# EAGLE design Esp8266_prot16_v5 (EAGLE 8.4.0)
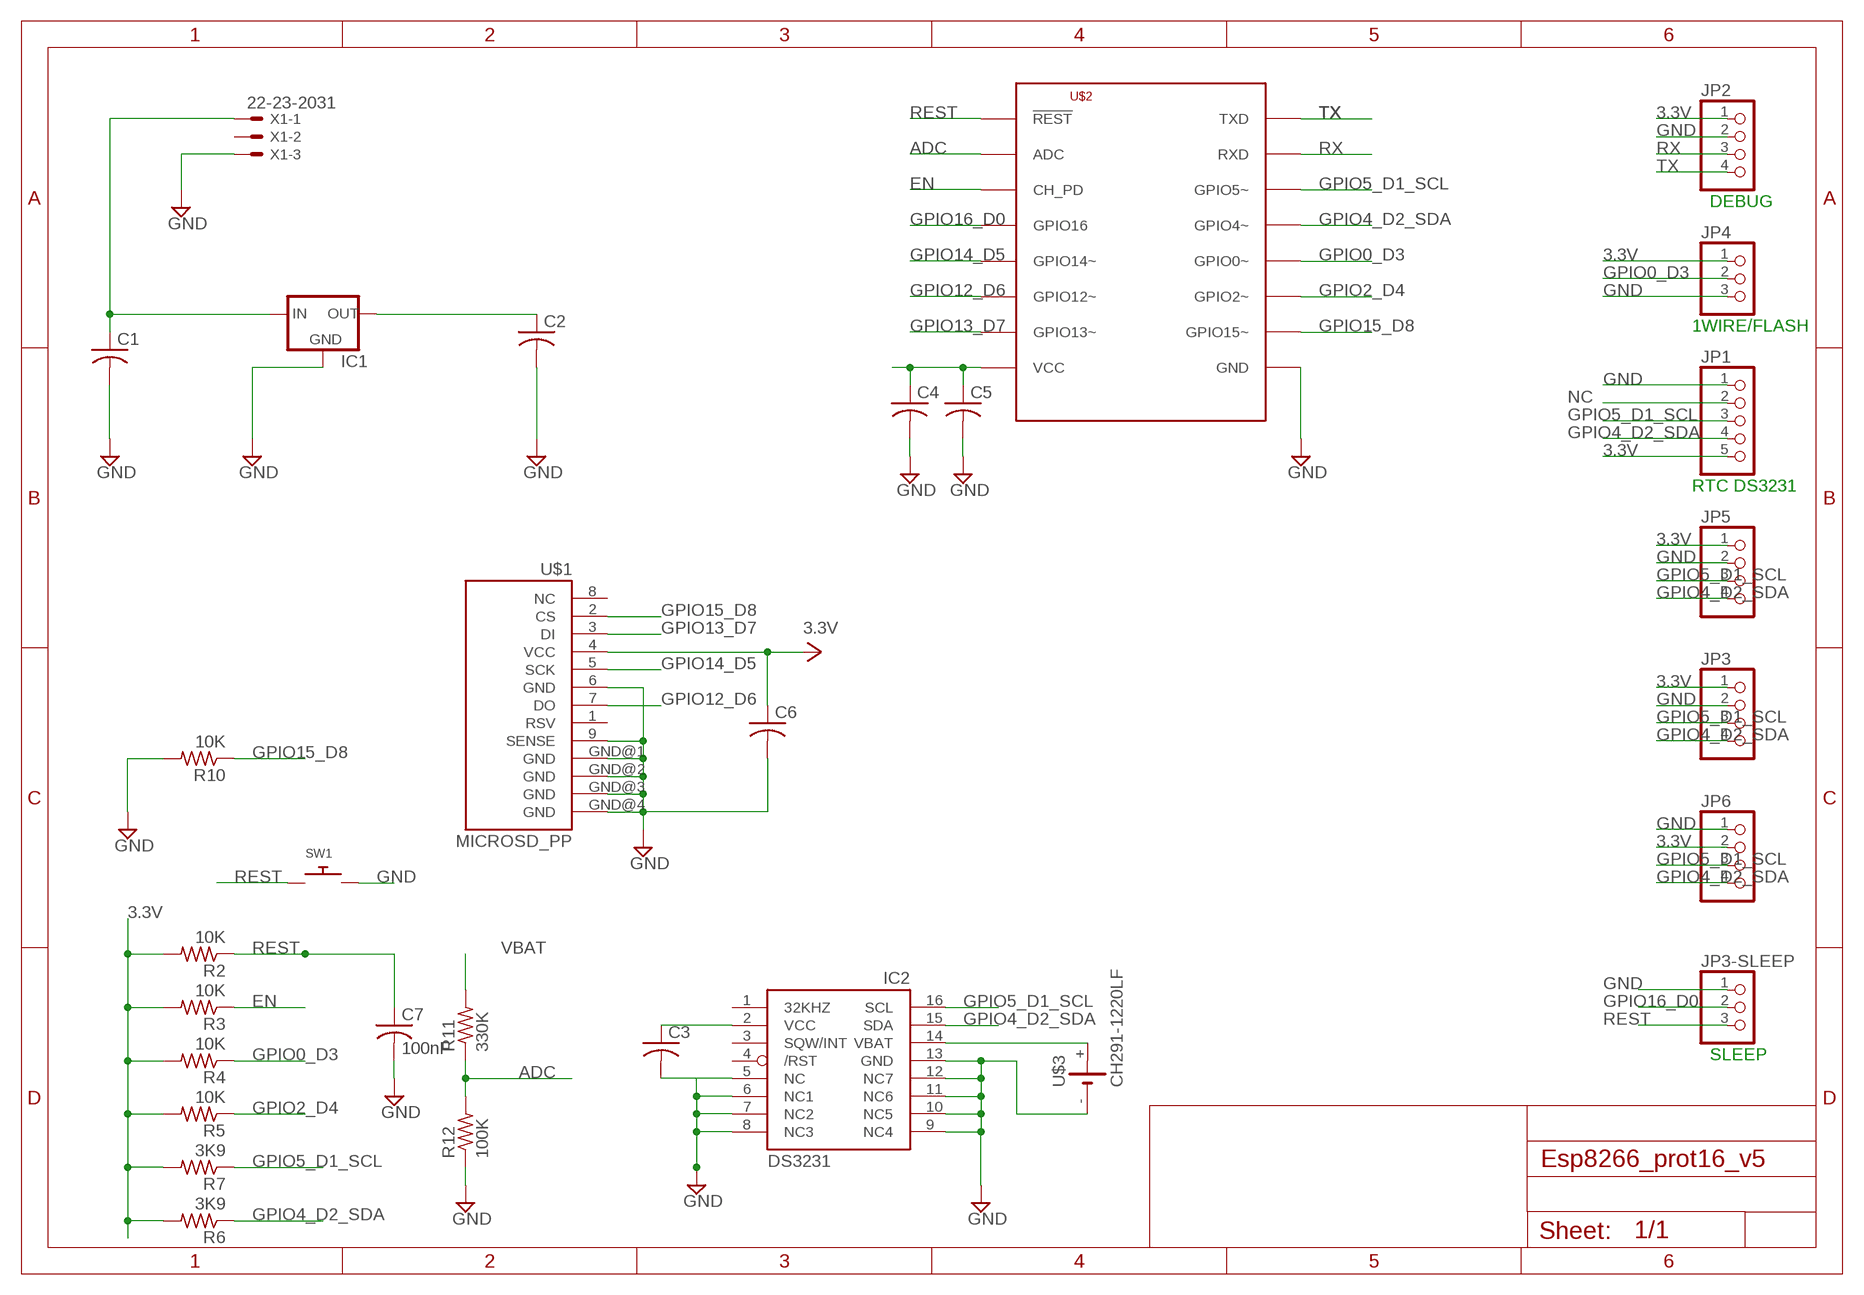
[diagram p0: schematic, sheet 1]

## Parts
C1  C-USC0805K  [C0805K]
C2  C-USC0805K  [C0805K]
C3  C-USC0805K  [C0805K]
C4  C-USC0805K  [C0805K]
C5  C-USC0805K  [C0805K]
C6  C-USC0805K  [C0805K]
C7  100nF  C-USC0805K  [C0805K]
IC1  XC63FPP  [SOT89R]
IC2  DS3231/SO  [SO16W]
JP1  PINHD-1X5/90  [1X05/90]
JP2  PINHD-1X4  [1X04]
JP3  PINHD-1X4/90  [1X04/90]
JP3-SLEEP  PINHD-1X3/90  [1X03/90]
JP4  PINHD-1X3  [1X03]
JP5  PINHD-1X4  [1X04]
JP6  PINHD-1X4  [1X04]
R2  10K  R-US_R0805  [R0805]
R3  10K  R-US_R0805  [R0805]
R4  10K  R-US_R0805  [R0805]
R5  10K  R-US_R0805  [R0805]
R6  3K9  R-US_R0805  [R0805]
R7  3K9  R-US_R0805  [R0805]
R10  10K  R-US_R0805  [R0805]
R11  330K  R-US_R0805  [R0805]
R12  100K  R-US_R0805  [R0805]
SW1  SWITCH_PUSHBUTTONEVQ-PE  [TACT_PANA-EVQ]
U$1  MICROSD_PP  [MICROSD_PP]
U$2  ESP8266-07  [ESP-07]
U$3  CH291-1220LF  [CH291-1220LF]
X1  22-23-2031  [22-23-2031]

## Nets
3.3V [3.3V]: C2.1 C3.1 C4.1 C5.1 C6.1 IC1.3(OUT) IC2.2(VCC) JP1.5 JP2.1 JP3.1 JP4.1 JP5.1 JP6.2 R2.2 R3.2 R4.2 R5.2 R6.2 R7.2 U$1.4(VCC) U$2.VCC
ADC: R11.1 R12.2 U$2.ADC
BATRTC: IC2.14(VBAT) U$3.+
EN: R3.1 U$2.CH_PD
GND [GND]: C1.2 C2.2 C3.2 C4.2 C5.2 C6.2 C7.2 IC1.1(GND) IC2.5(NC) IC2.6(NC1) IC2.7(NC2) IC2.8(NC3) IC2.9(NC4) IC2.10(NC5) IC2.11(NC6) IC2.12(NC7) IC2.13(GND) JP1.1 JP2.2 JP3-SLEEP.1 JP3.2 JP4.3 JP5.2 JP6.1 R10.2 R12.1 SW1.P$2 U$1.6(GND) U$1.9(SENSE) U$1.GND@1(GND) U$1.GND@2(GND) U$1.GND@3(GND) U$1.GND@4(GND) U$2.GND U$3.- X1.3
GPIO0_D3: JP4.2 R4.1 U$2.GPIO0(GPIO0~)
GPIO2_D4: R5.1 U$2.GPIO2(GPIO2~)
GPIO4_D2_SDA: IC2.15(SDA) JP1.4 JP3.4 JP5.4 JP6.4 R6.1 U$2.GPIO5(GPIO4~)
GPIO5_D1_SCL: IC2.16(SCL) JP1.3 JP3.3 JP5.3 JP6.3 R7.1 U$2.GPIO4(GPIO5~)
GPIO12_D6: U$1.7(DO) U$2.GPIO12(GPIO12~)
GPIO13_D7: U$1.3(DI) U$2.GPIO13(GPIO13~)
GPIO14_D5: U$1.5(SCK) U$2.GPIO14(GPIO14~)
GPIO15_D8: R10.1 U$1.2(CS) U$2.GPIO15(GPIO15~)
GPIO16_D0: JP3-SLEEP.2 U$2.GPIO16
NC: JP1.2
REST: C7.1 JP3-SLEEP.3 R2.1 SW1.P$1 U$2.REST(!REST)
RX: JP2.3 U$2.RXD
TX: JP2.4 U$2.TXD
VBAT: C1.1 IC1.2(IN) R11.2 X1.1
Unconnected: IC2.1(32KHZ) IC2.3(SQW/INT) IC2.4(/RST) U$1.1(RSV) U$1.8(NC) X1.2

## Notes on the sheet
- DEBUG
- 1WIRE/FLASH
- RTC DS3231
- SLEEP

## Library data of the parts
C1-C7 = adafruit:C-US: CAPACITOR, American symbol
IC1 = v-reg:XC63FP: Positiv Voltage Regulators www.torex.co.jp/english/product/pro02/pdf/0201_xc62fp.pdf
IC2 = adafruit:DS3231
JP1 = pinhead:PINHD-1X5: PIN HEADER
JP2 JP3 JP5 JP6 = pinhead:PINHD-1X4: PIN HEADER
JP3-SLEEP JP4 = pinhead:PINHD-1X3: PIN HEADER
R2-R7 R10-R12 = adafruit:R-US_: RESISTOR, American symbol
SW1 = adafruit:SWITCH_PUSHBUTTON: Buttons SOFTTOUCHSMD_SJ - Soft touch temporary push button (Super Junk Akihabara) Compatible with SKPMANE010 [Mouser: 688-SKPMAN] C&K_KSS = Digikey: KSS221GLFS
U$1 = DE1594-v2:MICROSD_PP
U$2 = lio:ESP8266
U$3 = battery:CH291-1220LF: Battery Holder, SMT, 12mm multicomp PART NO. CH291-1220LF Source: Data sheet <http://www.farnell.com/datasheets/1505860.pdf>
X1 = con-molex:22-23-2031: .100" (2.54mm) Center Header - 3 Pin; MF: MOLEX; MPN: 22-23-2031; OC_FARNELL: 1462950; OC_NEWARK: 30C0862

## Net classes
0 default: width 0.3 mm, drill 0.8 mm, clearance 0.3 mm
1 3.3V: width 0.4 mm, drill 0.8 mm, clearance 0.3 mm
2 GND: width 0.4 mm, drill 0.8 mm, clearance 0.3 mm
3 Vbat: width 0.4 mm, drill 0.8 mm, clearance 0.3 mm

## Board
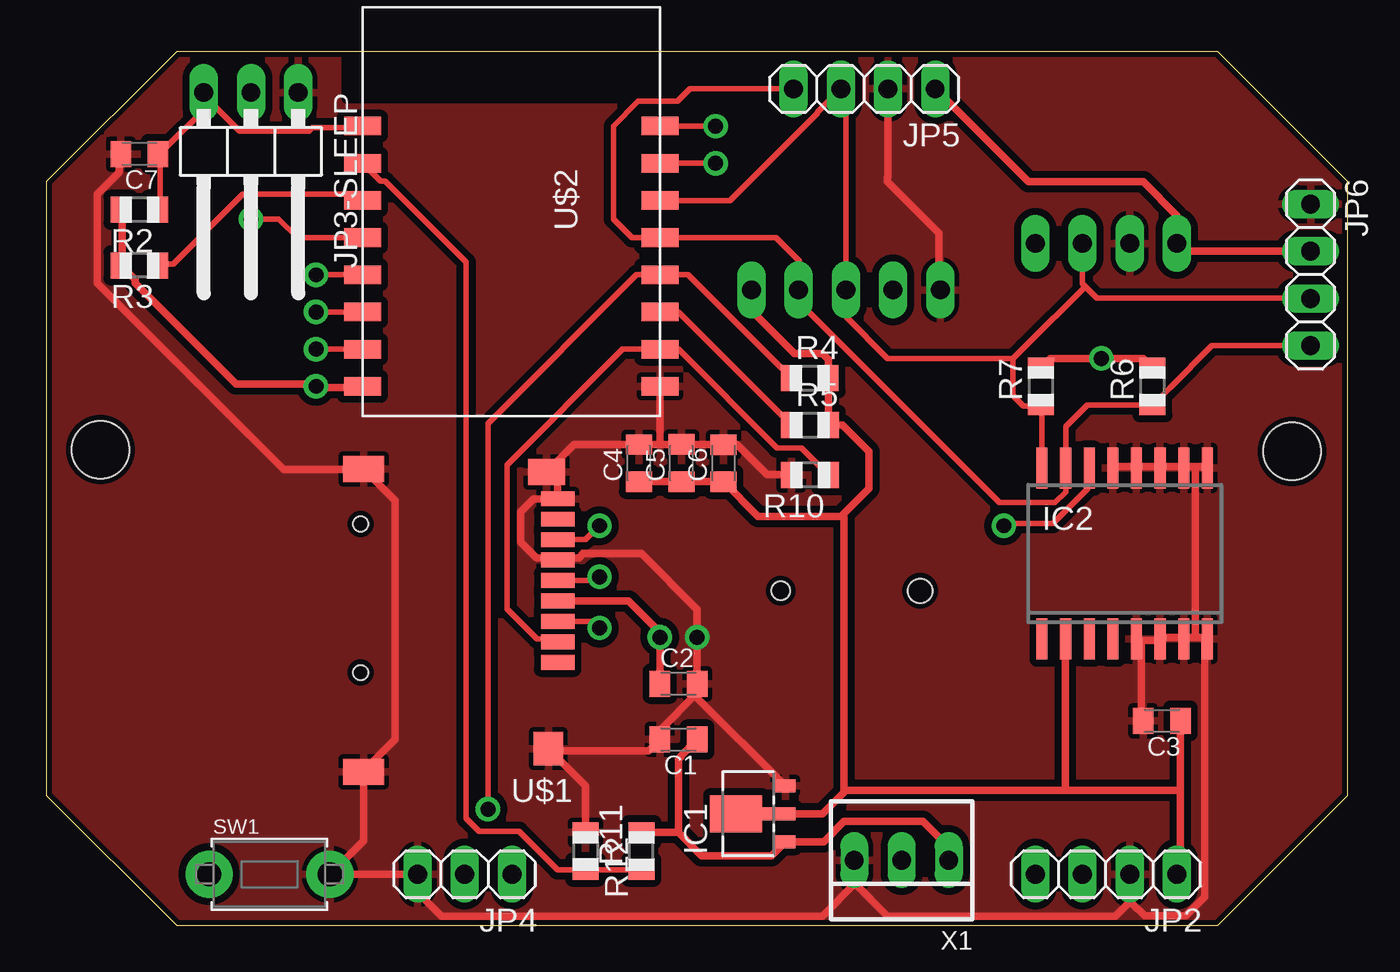
[diagram p1: board, top side]
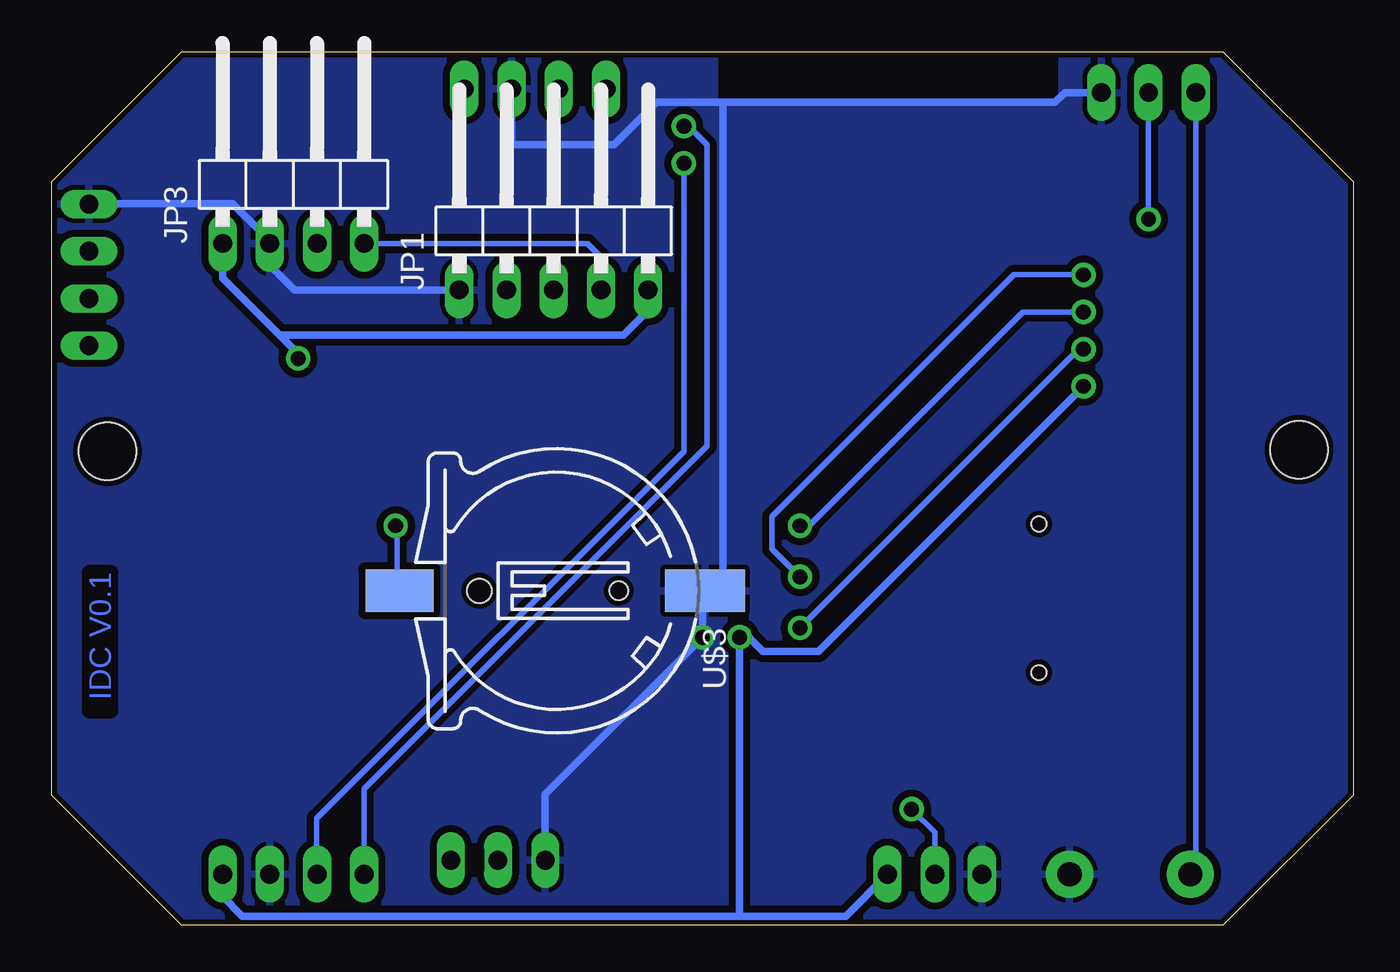
[diagram p2: board, bottom side, seen from below]

Size 70 x 47 mm. Coordinates in mm from the lower left corner, seen from the top.
Outline: 63,47 7,47 0,40 0,7 7,0 63,0 70,7 70,40 63,47
Copper layers (1*16): Top 0.035mm / dielectric 1.5mm / Bottom 0.035mm
Design rules "default *": minimum track width 0.3mm, minimum drill 0.8mm, track to track 15mil, track to pad 15mil, pad to pad 6mil, via to via 6mil, smd to smd 6mil, copper to edge 0.3mm, drill to drill 0.5mm, minimum pad ring 10mil, minimum via ring 10mil, stop-mask expansion 4mil, vias tented up to drill 0mil, thermal gap 10mil
Holes 3.1 mm at 2.9,25.6 67,25.5

### Footprints (pad centres in the part's own frame; a part is rotated, then mirrored left to right if it is on the bottom)
C0805K = smd 1.1 x 1.4: 1 -1,0; 2 1,0
SOT89R = smd 0.7 x 1.1: 1 1.5,-1.75; 2 -1.5,-1.75 | smd 0.7 x 1.8: 3 0,-1.4 | smd 2 x 2.8: 4 0,0.9
SO16W = smd 0.6 x 2.2: 1 -4.445,-4.6; 2 -3.175,-4.6; 3 -1.905,-4.6; 4 -0.635,-4.6; 5 0.635,-4.6; 6 1.905,-4.6; 7 3.175,-4.6; 8 4.445,-4.6; 9 4.445,4.6; 10 3.175,4.6; 11 1.905,4.6; 12 0.635,4.6; 13 -0.635,4.6; 14 -1.905,4.6; 15 -3.175,4.6; 16 -4.445,4.6
1X05/90 = drill 1.016 long: 1 -5.08,-3.81; 2 -2.54,-3.81; 3 0,-3.81; 4 2.54,-3.81; 5 5.08,-3.81
1X04 = drill 1.016 long: 1 -3.81,0; 2 -1.27,0; 3 1.27,0; 4 3.81,0
1X04/90 = drill 1.016 long: 1 -3.81,-3.81; 2 -1.27,-3.81; 3 1.27,-3.81; 4 3.81,-3.81
1X03/90 = drill 1.016 long: 1 -2.54,-3.81; 2 0,-3.81; 3 2.54,-3.81
1X03 = drill 1.016 long: 1 -2.54,0; 2 0,0; 3 2.54,0
R0805 = smd 1.1 x 1.4: 1 -1,0; 2 1,0
TACT_PANA-EVQ = drill 1.3 pad 2.54: P$1 -3.25,0; P$2 3.25,0
MICROSD_PP = smd 1.8 x 0.8: 1 0,3.85; 2 0,2.75; 3 0,1.65; 4 0,0.55; 5 0,-0.55; 6 0,-1.65; 7 0,-2.75; 8 0,-3.85; 9 0,-4.95 | smd 1.6 x 1.8: GND@1 0.5,8.5 | smd 2.2 x 1.4: GND@2 10.45,9.75; GND@4 10.45,-6.55 | smd 2 x 1.4: GND@3 0.6,-6.4 | hole 0.8: 10.6,4.4; 10.6,-3.6
ESP-07 = smd 1 x 2: ADC -1.6,-8; CH_PD 0.4,-8; GND 10.4,8; GPIO0 4.4,8; GPIO2 6.4,8; GPIO4 0.4,8; GPIO5 2.4,8; GPIO12 6.4,-8; GPIO13 8.4,-8; GPIO14 4.4,-8; GPIO15 8.4,8; GPIO16 2.4,-8; REST -3.6,-8; RXD -1.6,8; TXD -3.6,8; VCC 10.4,-8
CH291-1220LF = smd 2.3 x 3.66: + 0,-2.296 | smd 2.3 x 4.3: - 0,14.146 | hole 1.3: 0,2 | hole 1: 0,9.5
22-23-2031 = drill 1 long: 1 -2.54,0; 2 0,0; 3 2.54,0

### Placement (x,y rotation side)
C1  34,10 180 top
C2  34,13 0 top
C3  60,11 180 top
C4  31.87,24.87 90 top
C5  34.15,24.87 90 top
C6  36.42,24.87 90 top
C7  5,41.5 180 top
IC1  38,6 90 top
IC2  58,20 0 top
JP1  43,38 0 bottom
JP2  57,2.75 180 top
JP3  57,40.5 0 bottom
JP3-SLEEP  11,41 180 top
JP4  22.5,2.75 180 top
JP5  44,45 180 top
JP6  68,35 270 top
R2  5,38.5 180 top
R3  5,35.5 180 top
R4  41.07,29.45 0 top
R5  41.08,26.92 0 top
R6  59.5,29 90 top
R7  53.5,29 90 top
R10  41.07,24.23 180 top
R11  32,4 90 top
R12  29,4 270 top
SW1  12,2.75 0 top
U$1  27.5,18 180 top
U$2  25,39.4 270 top
U$3  49,18 270 bottom
X1  46,3.5 180 top

### Tracks (layer width: path | path; a pad name or v marks a point on that pad's centre or on a via)
3.3V  (via drill 0.8)
  Top 0.4: C2.1 v33,15.5 33,15.75 31.3,17.45 U$1.4 | C4.1 C5.1 C6.1 38.28,22 42.75,22 | JP2.1 61,2.69 61,7.25 | C3.1 61,7.25 | IC1.3 41.75,6 43,7.25 | 43,7.25 54.82,7.25 | 54.82,7.25 61,7.25 | JP1.5 38,34.11 38,33 40.25,30.75 41.75,30.75 42.07,30.43 R4.2 42.08,29.44 R5.2 42.83,26.92 44.25,25.5 44.25,23.5 42.75,22 | JP6.2 61.23,36.27 JP3.1 60.81,38.19 59,40 52.81,40 JP5.1 | R7.2 54,30.5 v56.75,30.5 59,30.5 R6.2 | R2.2 4.09,38.48 4.09,35.58 R3.2 4.09,35.41 4.77,34.73 4.77,34.56 10.21,29.11 14.47,29.11 v14.5,29 14.64,28.94 16.86,28.94 U$2.VCC | 54.82,7.25 54.82,15.32 IC2.2 | 42.75,22 42.9,21.96 42.9,7.32 43,7.25
  Bottom 0.4: v14.5,29 28.75,14.75 31.75,14.75 32.5,15.5 v33,15.5 33,0.5 | JP4.1 27.29,0.5 33,0.5 | 33,0.5 59.75,0.5 60.81,1.56 JP2.1 | JP1.5 38,34.11 38,33 39.25,31.75 57.75,31.75 | 57.75,31.75 60.81,34.81 JP3.1 | v56.75,30.5 56.75,30.75 57.75,31.75
ADC
  Top 0.3: U$2.ADC 17.97,40.03 18.22,40.03 22.57,35.69 22.57,5.76 23.26,5.07 25.43,5.07 27.5,3 R12.2 R11.1
BATRTC  (via drill 0.8)
  Top 0.3: IC2.14 56.01,24.52 56.01,23.49 54.14,21.62 51.59,21.62 v51.5,21.5
  Bottom 0.3: v51.5,21.5 51.42,21.45 51.42,18.05 U$3.+
EN
  Top 0.3: R3.1 6.13,35.58 6.81,35.58 10.56,39.33 16.68,39.33 16.86,39.16 U$2.CH_PD
GND  (via drill 0.8)
  Top 0.4: 33,25.87 C4.2 28.37,25.87 U$1.GND@3 27.5,23.8 U$1.9 26.2,22.95 25.5,22.25 25.5,20.63 26.36,19.77 27.38,19.77 U$1.6 27.62,19.77 28.64,19.77 28.87,20 32,20 35,17 v35,15.5 C2.2 | 33,25.87 C5.2 C6.2 37.13,25.87 38.75,24.25 40.05,24.25 R10.2 | U$2.GND 33,25.87 | C2.2 35,12.5 33,10.5 C1.2 32.38,9.38 27.12,9.38 | JP4.3 SW1.P$2 17.05,4.55 U$1.GND@2 17.05,8.3 18.75,10 18.75,22.85 U$1.GND@4 16.86,24.52 12.77,24.52 2.72,34.56 2.72,39.33 3.92,40.52 3.92,41.37 C7.2 | 27.12,9.38 U$1.GND@1 | 27.12,9.38 29,7.5 R12.1 | X1.3 43.5,3.46 43.5,2.25 | 43.5,2.25 45.25,0.5 57.5,0.5 58.27,1.27 | 58.27,1.27 JP2.2 | IC1.1 35,12.25 C2.2 | JP5.2 45.27,40.27 45.25,40.25 45.25,40 48,37.25 48,34.27 JP1.1 | JP4.3 20,2.71 20,1.75 | JP4.3 19.96,1.79 21.25,0.5 41.75,0.5 43.5,2.25 | 61.8,15.49 62.31,15.49 IC2.8 62.31,15.32 62.31,1.53 61.29,0.51 59.08,0.51 58.4,1.19 58.27,1.27 | 61.8,15.49 61.29,15.49 IC2.7 61.12,15.49 59.93,15.49 IC2.6 59.76,15.32 58.91,15.32 IC2.5 58.74,15.32 58.91,15.15 58.91,11.07 C3.2 | 61.8,24.69 62.31,24.69 IC2.9 | 61.8,24.69 61.29,24.69 IC2.10 61.12,24.69 59.93,24.69 IC2.11 59.76,24.69 58.74,24.69 IC2.12 58.57,24.69 57.37,24.69 IC2.13 | 61.8,24.69 61.8,15.49
  Bottom 0.4: JP1.1 56.94,34.19 58.27,35.52 JP3.2 58.23,36.77 60.27,38.82 67.93,38.82 JP6.1 | JP3-SLEEP.1 15.5,44.81 16.03,44.28 33.88,44.28 | 33.88,44.28 37.47,44.28 39.75,42 45.25,42 45.27,42.02 JP5.2 | X1.3 43.46,7.04 v35,15.5 35,17.85 U$3.- 34.73,18.05 33.88,18.9 33.88,44.28
  pour Bottom (isolate 0.254): 0,7 7,0 63,0 70,7 70,40 63,47 7,47 0,40
  pour Top (isolate 0.254): 0,40 0,7 7,0 63,0 70,7 70,40 63,47 7,47
GPIO0_D3  (via drill 0.8)
  Top 0.3: R4.1 34.51,35 U$2.GPIO0 31.75,35 23.75,27 v23.75,6.25
  Bottom 0.3: JP4.2 22.5,5 v23.75,6.25
GPIO2_D4
  Top 0.3: R5.1 33.99,33 U$2.GPIO2
GPIO4_D2_SDA
  Top 0.3: JP6.4 62.69,31.19 60.42,28.92 R6.1 56,28 54.83,26.82 IC2.15 54.83,23.32 54.25,22.75 51.25,22.75 40.5,33.5 40.5,34.15 JP1.4 40.5,34.23 40.5,35.75 39.25,37 U$2.GPIO5 31.5,37 30.5,38 30.5,43 31.83,44.33 33.95,44.33 34.62,45 JP5.4
  Bottom 0.3: JP1.4 40.5,34.23 40.5,36 41.19,36.69 JP3.4
GPIO5_D1_SCL
  Top 0.3: 53.55,27.95 IC2.16 | 53.55,27.95 R7.1 | JP6.3 67.98,33.75 56.5,33.75 55.88,34.38 | 55.88,34.38 55.73,34.52 JP3.3 | 55.88,34.38 52.58,31.08 52,30.5 | 52,30.5 52,28.5 52.55,27.95 53.55,27.95 | 52,30.5 45.25,30.5 43,32.75 JP1.3 43,44.73 JP5.3 41.48,43.75 41.48,43.7 36.78,39 U$2.GPIO4
GPIO12_D6  (via drill 0.8)
  Top 0.3: v14.5,33 U$2.GPIO12 | U$1.7 29,20.75 v29.75,21.5
  Bottom 0.3: v29.75,21.5 29.25,21.5 17.75,33 v14.5,33
GPIO13_D7  (via drill 0.8)
  Top 0.3: v14.5,31 U$2.GPIO13 | U$1.3 29.4,16.35 v29.75,16
  Bottom 0.3: v29.75,16 14.75,31 v14.5,31
GPIO14_D5  (via drill 0.8)
  Top 0.3: v14.5,35 U$2.GPIO14 | v29.75,18.75 29.55,18.55 U$1.5
  Bottom 0.3: v14.5,35 18.25,35 31.25,22 31.25,20.25 v29.75,18.75
GPIO15_D8
  Top 0.3: U$1.2 27.33,15.42 26.38,15.42 24.77,17.03 24.77,24.77 31,31 U$2.GPIO15 33.99,31 39.3,25.69 40.62,25.69 41.15,25.15 R10.1
GPIO16_D0  (via drill 0.8)
  Top 0.3: U$2.GPIO16 13.5,37 12.5,38 v11,38
  Bottom 0.3: v11,38 JP3-SLEEP.2
REST
  Top 0.3: R2.1 6.13,38.65 6.13,41.37 C7.1 6.13,41.54 8.85,44.27 | 8.85,44.27 8.34,44.78 JP3-SLEEP.3 8.85,44.27 | 8.85,44.27 10.38,42.73 14.13,42.73 14.3,42.9 16.86,42.9 U$2.REST
  Bottom 0.3: SW1.P$1 8.46,3.04 JP3-SLEEP.3
RX  (via drill 0.8)
  Top 0.3: U$2.RXD v36,41
  Bottom 0.3: v36,41 36,25.5 55.75,5.75 55.75,2.52 JP2.3
TX  (via drill 0.8)
  Top 0.3: U$2.TXD v36,43
  Bottom 0.3: JP2.4 53.19,7.35 34.75,25.79 34.75,42 35.75,43 v36,43
VBAT
  Top 0.4: 34,5 R11.2 | 34,5 35.25,3.75 39,3.75 IC1.2 41.82,4.5 42.91,5.59 47.16,5.59 48.54,4.21 X1.1 | C1.1 34.13,9.13 34.13,9.06 34,8.93 34,5

### Text on the board
Bottom: IDC V0.1